# EAGLE design kontrol (EAGLE 6.6.0)
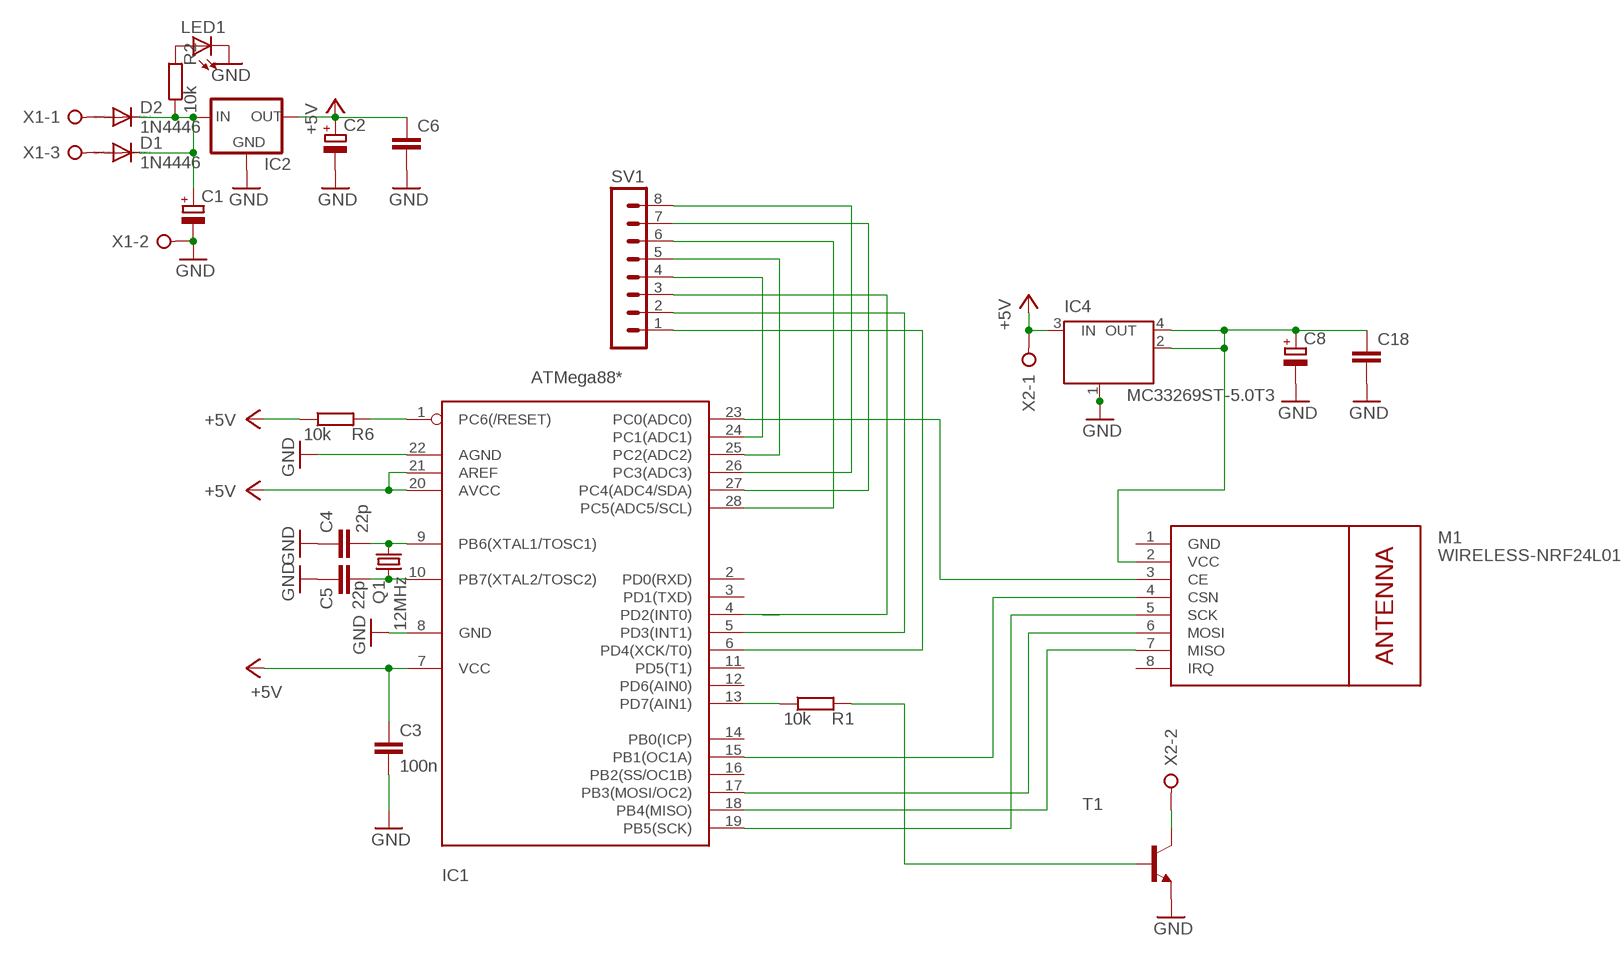
[diagram p0: schematic, sheet 1]

## Parts
C1  CPOL-EUE5-8.5  [E5-8,5]
C2  CPOL-EUE2.5-6  [E2,5-6]
C3  100n  C-EU025-024X044  [C025-024X044]
C4  22p  C-EU025-024X044  [C025-024X044]
C5  22p  C-EU025-024X044  [C025-024X044]
C6  C-EU075-042X103  [C075-042X103]
C8  CPOL-EUE2.5-6  [E2,5-6]
C18  C-EU075-042X103  [C075-042X103]
D1  1N4446  [DO35-10]
D2  1N4446  [DO35-10]
IC1  ATMega88*  MEGA8-P  [DIL28-3]
IC2  78XXL  [78XXL]
IC4  MC33269ST-5.0T3  MC33269ST-3.3T3  [SOT223]
LED1  LEDB152  [Q62902-B152]
M1  WIRELESS-NRF24L01  [WIRELESS-NRF24L01]
Q1  12MHz  CRYTALHC49S  [HC49/S]
R1  10k  R-EU_0207/10  [0207/10]
R2  10k  R-EU_0207/10  [0207/10]
R6  10k  R-EU_0207/10  [0207/10]
SV1  MA08-1  [MA08-1]
T1  BC548-NPN-TO92-CBE  [TO92-CBE]
X1  W237-3E  [W237-3E]
X2  W237-02P  [W237-132]

## Nets
+5V: C2.+ C3.1 C6.1 IC1.7(VCC) IC1.20(AVCC) IC1.21(AREF) IC2.OUT IC4.3(IN) R6.1 X2.1
+5V1: C8.+ C18.1 IC4.2(OUT) IC4.4(OUT) M1.2(VCC)
GND: C1.- C2.- C3.2 C4.1 C5.1 C6.2 C8.- C18.2 IC1.8(GND) IC1.22(AGND) IC2.GND IC4.1(GND/ADJ) LED1.K(C) T1.E X1.2
N$1: IC1.1(PC6(/RESET)) R6.2
N$2: IC1.6(PD4(XCK/T0)) SV1.1
N$3: IC1.5(PD3(INT1)) SV1.2
N$4: IC1.4(PD2(INT0)) SV1.3
N$5: IC1.24(PC1(ADC1)) SV1.4
N$6: IC1.17(PB3(MOSI/OC2)) M1.6(MOSI)
N$7: IC1.25(PC2(ADC2)) SV1.5
N$8: IC1.26(PC3(ADC3)) SV1.8
N$9: IC1.18(PB4(MISO)) M1.7(MISO)
N$10: IC1.19(PB5(SCK)) M1.5(SCK)
N$11: IC1.23(PC0(ADC0)) M1.3(CE)
N$12: IC1.15(PB1(OC1A)) M1.4(CSN)
N$13: IC1.27(PC4(ADC4/SDA)) SV1.7
N$14: IC1.28(PC5(ADC5/SCL)) SV1.6
N$15: C1.+ D1.C D2.C IC2.IN R2.1
N$16: D2.A X1.1
N$17: D1.A X1.3
N$18: T1.C X2.2
N$19: IC1.13(PD7(AIN1)) R1.1
N$20: R1.2 T1.B
N$21: LED1.A R2.2
N$22: C4.2 IC1.9(PB6(XTAL1/TOSC1)) Q1.2
N$23: C5.2 IC1.10(PB7(XTAL2/TOSC2)) Q1.1
Unconnected: IC1.2(PD0(RXD)) IC1.3(PD1(TXD)) IC1.11(PD5(T1)) IC1.12(PD6(AIN0)) IC1.14(PB0(ICP)) IC1.16(PB2(SS/OC1B)) M1.8(IRQ)

## Power pins joined to a net without a drawn wire
GND: M1.1(GND)

## Library data of the parts
C1 C2 C8 = rcl:CPOL-EU: POLARIZED CAPACITOR, European symbol
C3-C6 C18 = rcl:C-EU: CAPACITOR, European symbol
D1 D2 = diode:1N4446: DIODE high speed (Philips)
IC1 = atmel:MEGA8-P: MICROCONTROLLER 8 Kbytes FLASH 1 kbytes SRAM 512 bytes EEPROM USART 4-channel 10 bit ADC 2-channel 8 bit ADC Source: avr.lbr
IC2 = v-reg:78XXL: VOLTAGE REGULATOR
IC4 = linear:MC33269ST*: Adjustable Output Low Dropout Voltage Regulator 800 mA Source: http://www.onsemi.com/pub/Collateral/MC33269-D.PDF
LED1 = led:LED: LED OSRAM: - CHIPLED LG R971, LG N971, LY N971, LG Q971, LY Q971, LO R971, LY R971 LH N974, LH R974 LS Q976, LO Q976, LY Q976 LO Q996 - Hyper CHIPLED LW Q18S LB Q993, LB Q99A, LB R99A - SideLED LS A670, LO A670, LY A670, LG A670, LP A670 LB A673, LV A673, LT A673, LW A673 LH A674 LY A675 LS A676, LA A676, LO A676, LY A676, LW A676 LS A679, LY A679, LG A679 - Hyper Micro SIDELED® LS Y876, LA Y876, LO Y876, LY Y876 LT Y87S - SmartLED LW L88C, LW L88S LB L89C, LB L89S, LG L890 LS L89K, LO L89K, LY L89K LS L896, LA L896, LO L896, LY L896 - TOPLED LS T670, LO T670, LY T670, LG T670, LP T670 LSG T670, LSP T670, LSY T670, LOP T670, LYG T670 LG T671, LOG T671, LSG T671 LB T673, LV T673, LT T673, LW T673 LH T674 LS T676, LA T676, LO T676, LY T676, LB T676, LH T676, LSB T676, LW T676 LB T67C, LV T67C, LT T67C, LS T67K, LO T67K, LY T67K, LW E67C LS E67B, LA E67B, LO E67B, LY E67B, LB E67C, LV E67C, LT E67C LW T67C LS T679, LY T679, LG T679 LS T770, LO T770, LY T770, LG T770, LP T770 LB T773, LV T773, LT T773, LW T773 LH T774 LS E675, LA E675, LY E675, LS T675 LS T776, LA T776, LO T776, LY T776, LB T776 LHGB T686 LT T68C, LB T68C - Hyper Mini TOPLED® LB M676 - Mini TOPLED Santana® LG M470 LS M47K, LO M47K, LY M47K Source: http://www.osram.convergy.de LUXEON: - LUMILED® LXK2-PW12-R00, LXK2-PW12-S00, LXK2-PW14-U00, LXK2-PW14-V00 LXK2-PM12-R00, LXK2-PM12-S00, LXK2-PM14-U00 LXK2-PE12-Q00, LXK2-PE12-R00, LXK2-PE12-S00, LXK2-PE14-T00, LXK2-PE14-U00 LXK2-PB12-K00, LXK2-PB12-L00, LXK2-PB12-M00, LXK2-PB14-N00, LXK2-PB14-P00, LXK2-PB14-Q00 LXK2-PR12-L00, LXK2-PR12-M00, LXK2-PR14-Q00, LXK2-PR14-R00 LXK2-PD12-Q00, LXK2-PD12-R00, LXK2-PD12-S00 LXK2-PH12-R00, LXK2-PH12-S00 LXK2-PL12-P00, LXK2-PL12-Q00, LXK2-PL12-R00 Source: www.luxeon.com KINGBRIGHT: KA-3528ASYC Source: www.kingbright.com
M1 = diy-modules:WIRELESS-NRF24L01: 2.4 GHz Wireless Module based on NRF24L01 chip More details available here: http://www.electrodragon.com/w/NRF24L01 Click here to find device on ebay.com <http://www.ebay.com/sch/nrf24l01+arduino>
Q1 = crystal:CRYTAL: CRYSTAL
R1 R2 R6 = rcl:R-EU_: RESISTOR, European symbol
SV1 = con-lstb:MA08-1: PIN HEADER; OC_FARNELL: unknown; OC_NEWARK: unknown
T1 = transistor:*-NPN-: NPN Transistror BF959 corrected 2008.03.06
X1 = con-wago-508:W237-3E: WAGO SREW CLAMP; OC_FARNELL: unknown; OC_NEWARK: unknown
X2 = con-wago-508:W237-02P: WAGO SREW CLAMP; OC_FARNELL: unknown; OC_NEWARK: unknown

## Net classes
0 default: width 0.152 mm, drill 0.305 mm, clearance 0.152 mm

## Board
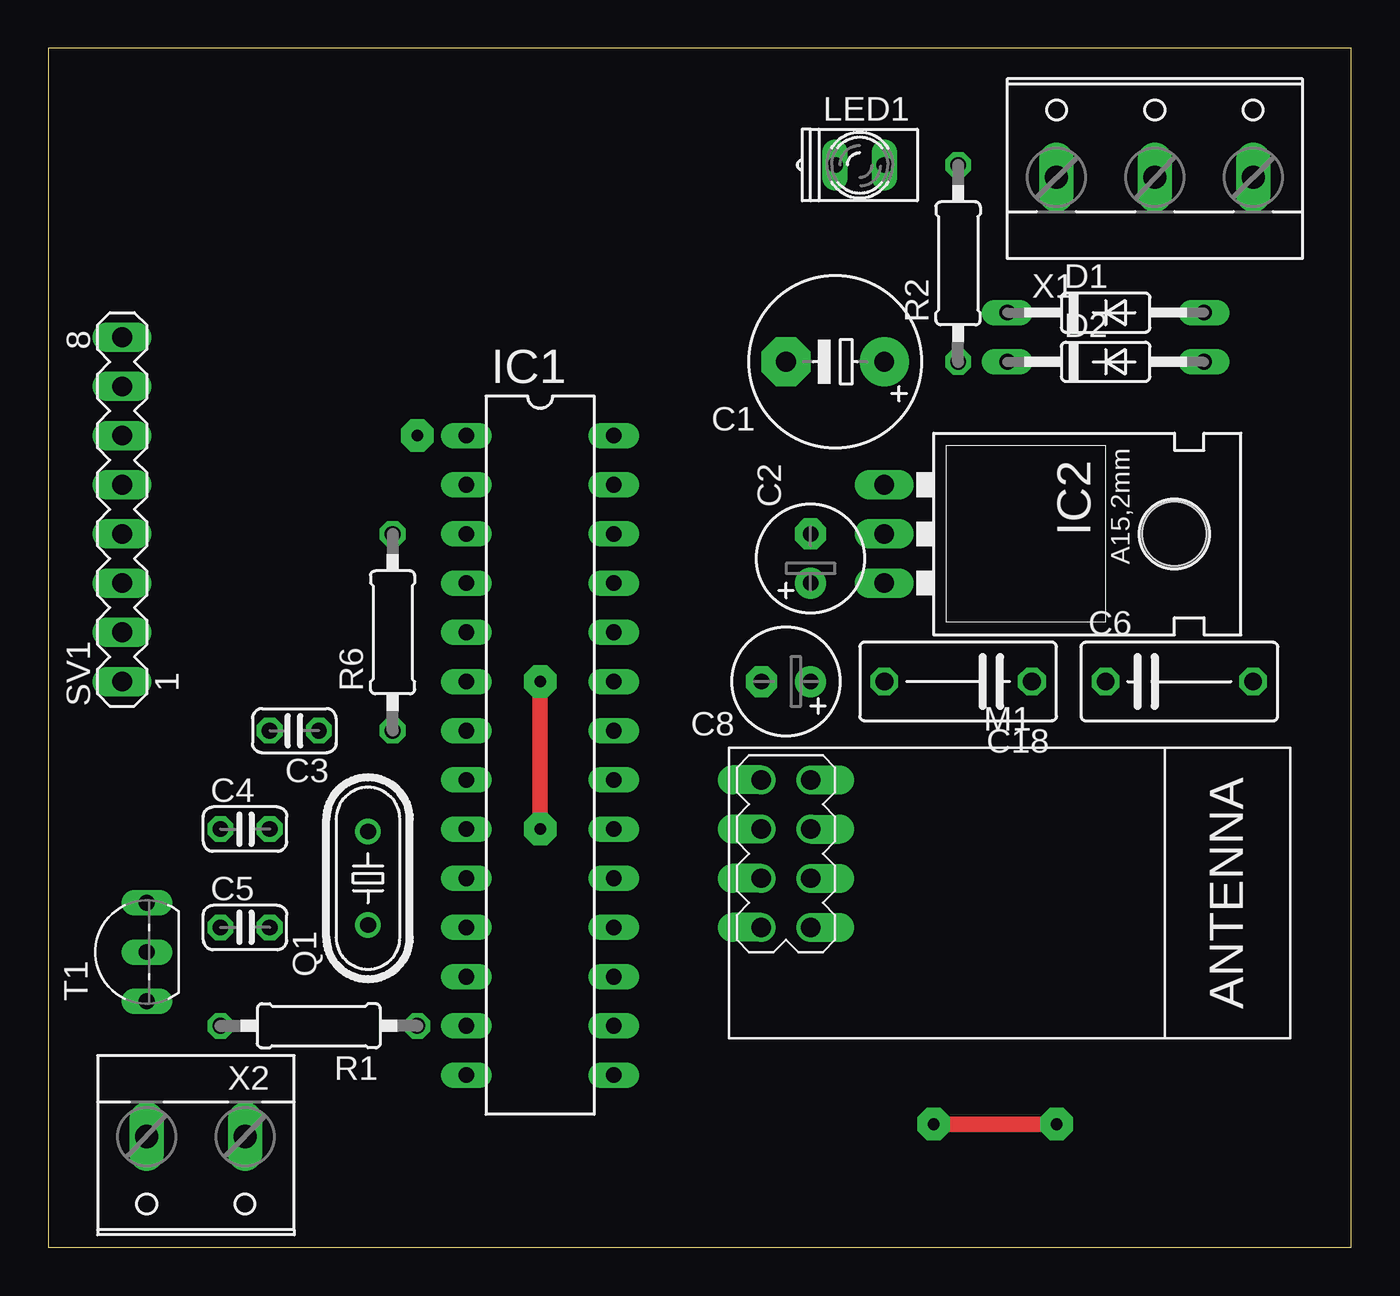
[diagram p1: board, top side]
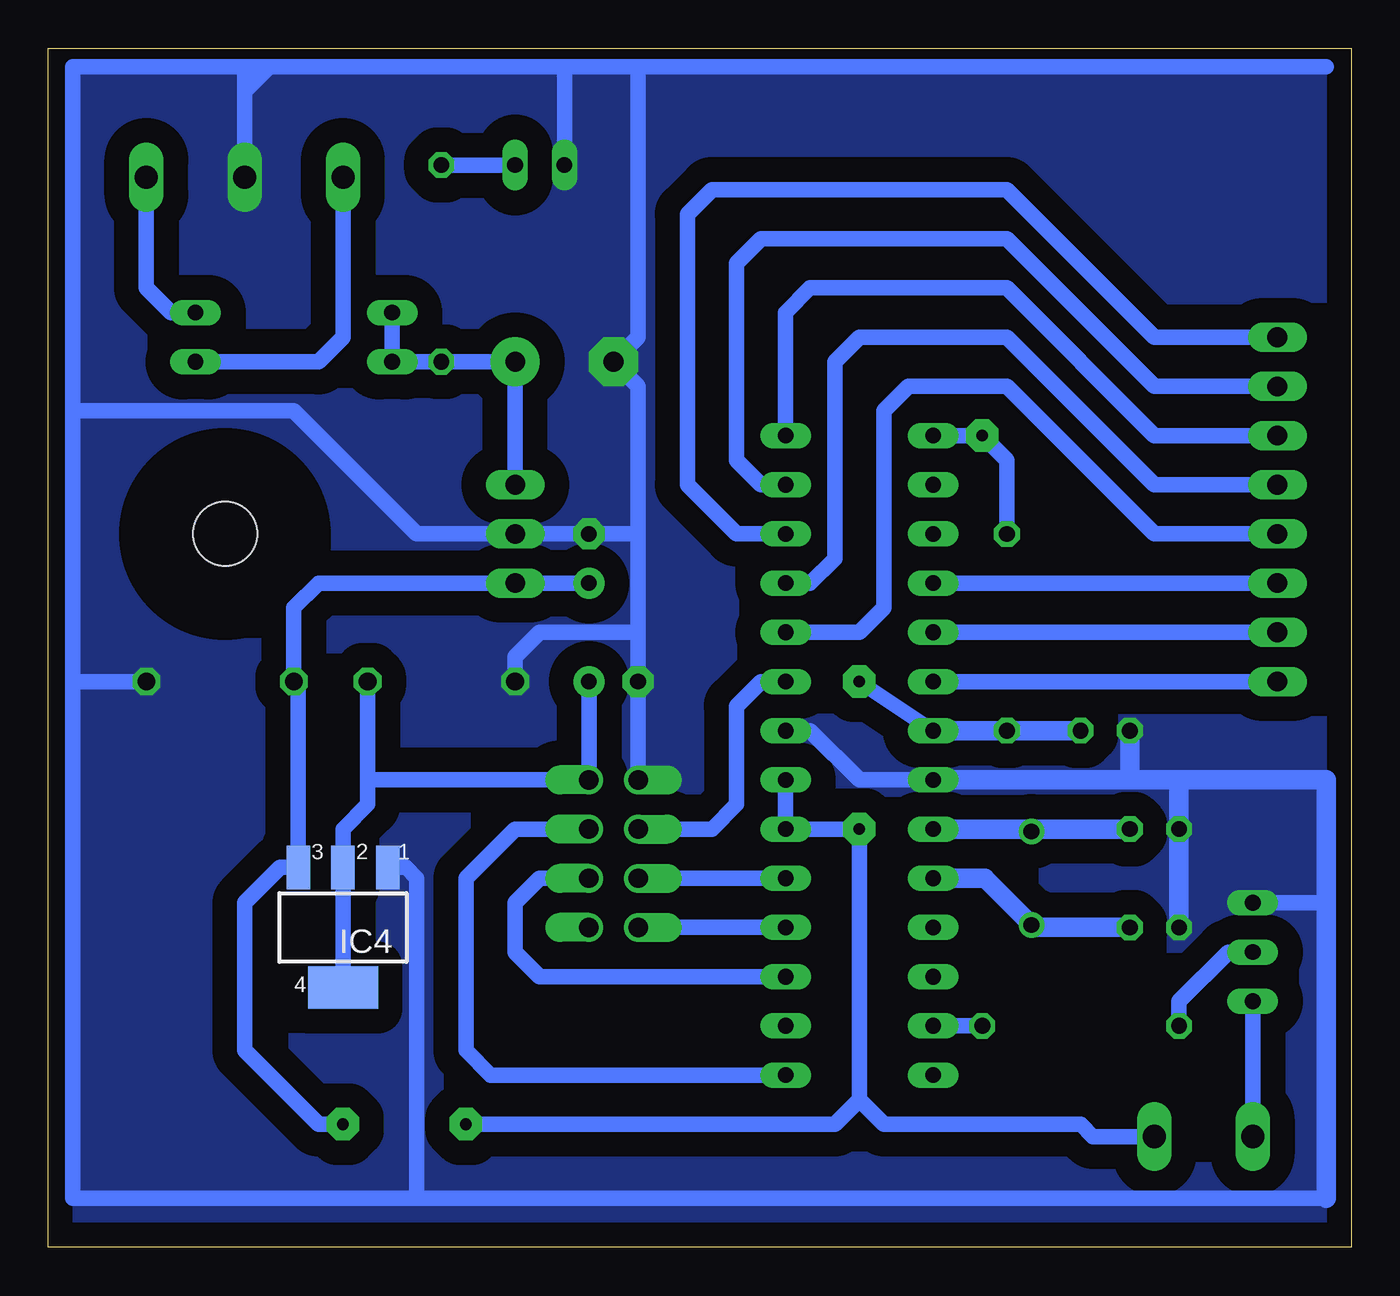
[diagram p2: board, bottom side, seen from below]

Size 67.29 x 61.9 mm. Coordinates in mm from the lower left corner, seen from the top.
Outline: 0,0 67.29,0 67.29,61.9 0,61.9 0,0
Copper layers (1*16): Top 0.035mm / dielectric 1.5mm / Bottom 0.035mm
Design rules "default": minimum track width 10mil, minimum drill 24mil, track to track 8mil, track to pad 8mil, pad to pad 8mil, via to via 8mil, smd to smd 8mil, copper to edge 40mil, drill to drill 8mil, minimum pad ring 10mil, minimum via ring 8mil, stop-mask expansion 4mil, vias tented up to drill 0mil, thermal gap 10mil

### Footprints (pad centres in the part's own frame; a part is rotated, then mirrored left to right if it is on the bottom)
E5-8,5 = drill 1.016 pad 2.54: + -2.54,0 | drill 1.016 pad 2.54 octagon: - 2.54,0
E2,5-6 = drill 0.813 pad 1.6: + -1.27,0 | drill 0.813 pad 1.6 octagon: - 1.27,0
C025-024X044 = drill 0.813 octagon: 1 -1.27,0; 2 1.27,0
C075-042X103 = drill 0.914 octagon: 1 -3.81,0; 2 3.81,0
DO35-10 = drill 0.813 long: A 5.08,0; C -5.08,0
DIL28-3 = drill 0.813 long: 1 -16.51,-3.81; 2 -13.97,-3.81; 3 -11.43,-3.81; 4 -8.89,-3.81; 5 -6.35,-3.81; 6 -3.81,-3.81; 7 -1.27,-3.81; 8 1.27,-3.81; 9 3.81,-3.81; 10 6.35,-3.81; 11 8.89,-3.81; 12 11.43,-3.81; 13 13.97,-3.81; 14 16.51,-3.81; 15 16.51,3.81; 16 13.97,3.81; 17 11.43,3.81; 18 8.89,3.81; 19 6.35,3.81; 20 3.81,3.81; 21 1.27,3.81; 22 -1.27,3.81; 23 -3.81,3.81; 24 -6.35,3.81; 25 -8.89,3.81; 26 -11.43,3.81; 27 -13.97,3.81; 28 -16.51,3.81
78XXL = drill 1.016 long: GND 0,-3.81; IN -2.54,-3.81; OUT 2.54,-3.81 | hole 3.302: 0,11.176
SOT223 = smd 1.219 x 2.235: 1 -2.311,-3.099; 2 0,-3.099; 3 2.311,-3.099 | smd 3.6 x 2.2: 4 0,3.099
Q62902-B152 = drill 0.813 long: A 1.27,0; K -1.27,0
WIRELESS-NRF24L01 = drill 1 offset: 1 -12.7,6.35; 2 -10.16,6.35; 3 -12.7,3.81; 4 -10.16,3.81; 5 -12.7,1.27; 6 -10.16,1.27; 7 -12.7,-1.27; 8 -10.16,-1.27
HC49/S = drill 0.813: 1 -2.413,0; 2 2.413,0
0207/10 = drill 0.813 octagon: 1 -5.08,0; 2 5.08,0
MA08-1 = drill 1.016 long: 1 -8.89,0; 2 -6.35,0; 3 -3.81,0; 4 -1.27,0; 5 1.27,0; 6 3.81,0; 7 6.35,0; 8 8.89,0
TO92-CBE = drill 0.813 long: B 0,0; C -2.54,0; E 2.54,0
W237-3E = drill 1.194 long: 1 -5.08,-0.635; 2 0,-0.635; 3 5.08,-0.635
W237-132 = drill 1.194 long: 1 -2.54,-0.635; 2 2.54,-0.635

### Placement (x,y rotation side)
C1  40.64,45.72 180 top
C2  39.37,35.56 90 top
C3  12.7,26.67 180 top
C4  10.16,21.59 0 top
C5  10.16,16.51 0 top
C6  58.42,29.21 0 top
C8  38.1,29.21 180 top
C18  46.99,29.21 180 top
D1  54.61,48.26 0 top
D2  54.61,45.72 0 top
IC1  25.4,25.4 270 top
IC2  46.99,36.83 270 top
IC4  52.07,16.51 180 bottom
LED1  41.91,55.88 0 top
M1  49.53,17.78 0 top
Q1  16.51,19.05 90 top
R1  13.97,11.43 180 top
R2  46.99,50.8 90 top
R6  17.78,31.75 90 top
SV1  3.81,38.1 90 top
T1  5.08,15.24 90 top
X1  57.15,55.88 0 top
X2  7.62,5.08 180 top

### Tracks (layer width: path | path; a pad name or v marks a point on that pad's centre or on a via)
+5V  (via drill 0.6 pad 1.68)
  Top 0.813: v25.4,29.21 v25.4,21.59 | v52.07,6.35 v45.72,6.35
  Bottom 0.813: IC1.7 v25.4,29.21 | 25.4,7.62 v25.4,21.59 IC1.20 IC1.21 | 25.4,7.62 26.67,6.35 v45.72,6.35 | v52.07,6.35 53.34,6.35 57.15,10.16 57.15,17.78 55.32,19.61 IC4.3 54.38,29.44 C6.1 54.61,33.02 53.34,34.29 IC2.OUT C2.+ | X2.1 13.33,5.71 13.97,6.35 24.13,6.35 25.4,7.62
  Bottom 1.016: IC1.7 R6.1 C3.1
+5V1
  Bottom 0.813: IC4.4 IC4.2 52.07,21.59 50.8,22.86 50.8,24.13 | 50.8,24.13 M1.2 C8.+ | C18.1 50.8,24.13
GND
  Bottom 0.813: 48.26,2.54 1.27,2.54 | 66.04,29.21 66.04,2.54 48.26,2.54 | 66.04,43.18 54.61,43.18 48.26,36.83 IC2.GND C2.- 36.83,36.83 | 66.04,43.18 66.04,29.21 | C6.2 66.04,29.21 | 36.83,60.96 36.83,46.99 C1.- 36.83,44.45 36.83,36.83 | 36.83,60.96 40.64,60.96 | 55.88,60.96 57.15,60.96 | 57.15,60.96 66.04,60.96 66.04,43.18 | 1.27,60.96 36.83,60.96 | IC4.1 48.82,19.61 48.26,19.05 48.26,2.54 | M1.1 C8.- 36.83,31.75 | IC1.22 27.94,26.67 25.4,24.13 IC1.8 | 36.83,31.75 36.83,36.83 | C18.2 43.18,30.48 41.91,31.75 36.83,31.75 | X1.2 57.15,59.69 | 57.15,59.69 57.15,60.96 | T1.E 1.27,17.78 | LED1.K 40.64,60.96 | 40.64,60.96 55.88,60.96 | 55.88,60.96 57.15,59.69
  Bottom 1.016: IC1.8 11.43,24.13 | 11.43,24.13 8.89,24.13 | 8.89,24.13 1.27,24.13 1.27,17.78 1.27,2.54 | C3.2 11.43,24.13 | C5.1 C4.1 8.89,24.13
  pour Bottom (isolate 1.27, no thermals): 0,60.96 66.04,60.96 66.04,0 0,0
N$1  (via drill 0.6 pad 1.68)
  Bottom 0.813: IC1.1 v19.05,41.91 17.78,40.64 R6.2
N$2
  Bottom 0.813: SV1.1 IC1.6
N$3
  Bottom 0.813: IC1.5 SV1.2
N$4
  Bottom 0.813: SV1.3 IC1.4
N$5
  Bottom 0.813: SV1.4 10.16,36.83 17.78,44.45 22.86,44.45 24.13,43.18 24.13,33.02 25.4,31.75 IC1.24
N$6
  Bottom 0.813: M1.6 41.91,19.05 43.18,17.78 43.18,15.24 41.91,13.97 IC1.17
N$7
  Bottom 0.813: IC1.25 27.94,34.29 26.67,35.56 26.67,45.72 25.4,46.99 17.78,46.99 10.16,39.37 SV1.5
N$8
  Bottom 0.813: SV1.8 10.16,46.99 17.78,54.61 33.02,54.61 34.29,53.34 34.29,39.37 31.75,36.83 IC1.26
N$9
  Bottom 0.813: IC1.18 M1.7
N$10
  Bottom 0.813: IC1.19 M1.5
N$11
  Bottom 0.813: IC1.23 30.48,29.21 31.75,27.94 31.75,22.86 33.02,21.59 M1.3
N$12
  Bottom 0.813: IC1.15 44.45,8.89 45.72,10.16 45.72,19.05 43.18,21.59 M1.4
N$13
  Bottom 0.813: IC1.27 30.48,39.37 31.75,40.64 31.75,50.8 30.48,52.07 17.78,52.07 10.16,44.45 SV1.7
N$14
  Bottom 0.813: SV1.6 10.16,41.91 17.78,49.53 27.94,49.53 29.21,48.26 IC1.28
N$15
  Bottom 0.813: IC2.IN C1.+ D2.C | R2.1 D2.C | D2.C D1.C
N$16
  Bottom 0.813: X1.1 52.07,46.99 53.34,45.72 D2.A
N$17
  Bottom 0.813: X1.3 62.23,49.53 60.96,48.26 D1.A
N$18
  Bottom 0.813: T1.C X2.2
N$19
  Bottom 0.813: R1.1 IC1.13
N$20
  Bottom 0.813: T1.B 6.35,15.24 8.89,12.7 R1.2
N$21
  Bottom 0.813: R2.2 LED1.A
N$22
  Bottom 1.016: IC1.9 16.51,21.59 | C4.2 16.51,21.59 | 16.51,21.59 Q1.2
N$23
  Bottom 1.016: C5.2 16.51,16.51 Q1.1 18.92,19.05 IC1.10